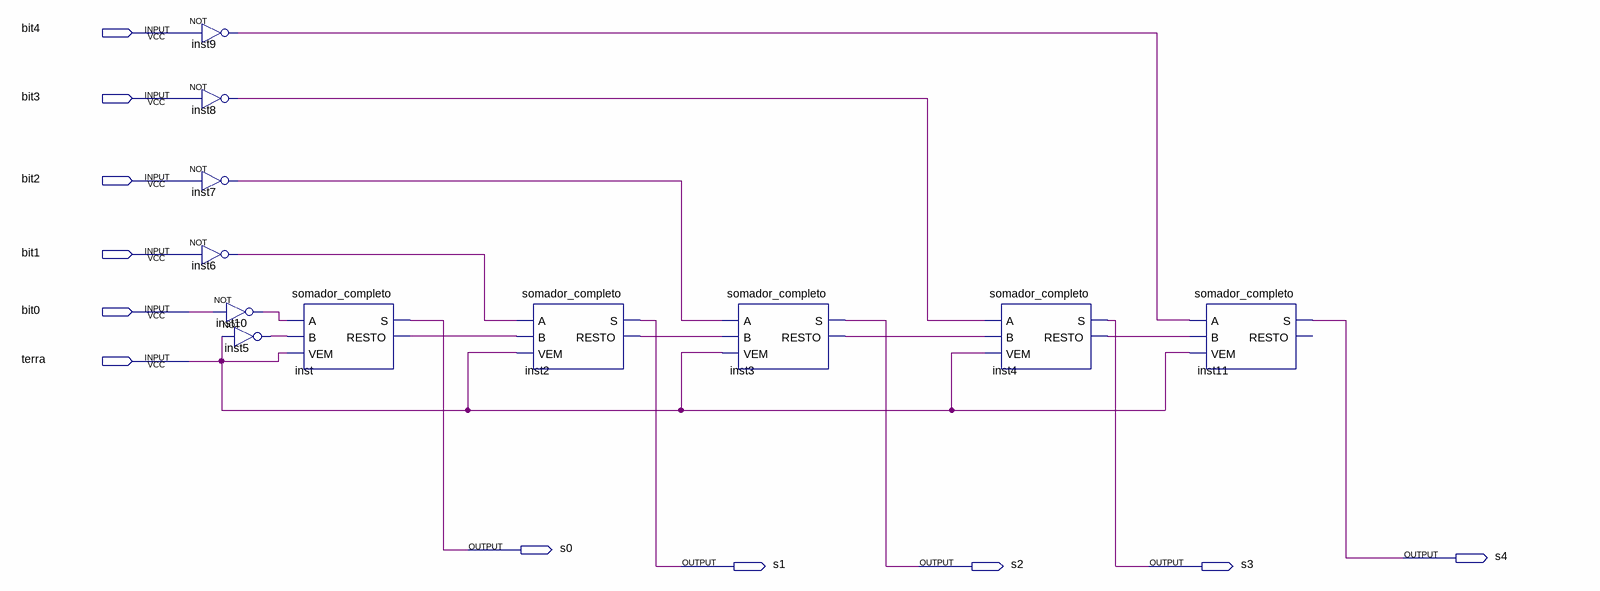
[diagram p0: schematic sheet]
// Quartus schematic CPL2.bdf as structural Verilog: 11 symbols, 11 pins
module CPL2 (
  input  bit4,
  input  bit3,
  input  bit2,
  input  bit1,
  input  bit0,
  input  terra,
  output s0,
  output s4,
  output s1,
  output s2,
  output s3
);

  wire inst2_resto, inst3_resto, inst4_resto, inst5_out, inst6_out, inst7_out, inst8_out, inst9_out,
       inst10_out, inst_resto;

  not inst9 (inst9_out, bit4);
  not inst8 (inst8_out, bit3);
  not inst7 (inst7_out, bit2);
  not inst6 (inst6_out, bit1);
  not inst10 (inst10_out, bit0);
  not inst5 (inst5_out, terra);
  somador_completo inst (.A(inst10_out), .B(inst5_out), .VEM(terra), .S(s0), .RESTO(inst_resto));
  somador_completo inst2 (.A(inst6_out), .B(inst_resto), .VEM(terra), .S(s1), .RESTO(inst2_resto));
  somador_completo inst3 (.A(inst7_out), .B(inst2_resto), .VEM(terra), .S(s2), .RESTO(inst3_resto));
  somador_completo inst4 (.A(inst8_out), .B(inst3_resto), .VEM(terra), .S(s3), .RESTO(inst4_resto));
  somador_completo inst11 (.A(inst9_out), .B(inst4_resto), .VEM(terra), .S(s4));  // open: RESTO
endmodule
